# Altium schematic sheet external_devices.SchDoc
size A4; SheetNumber: 4; SheetTotal: 4
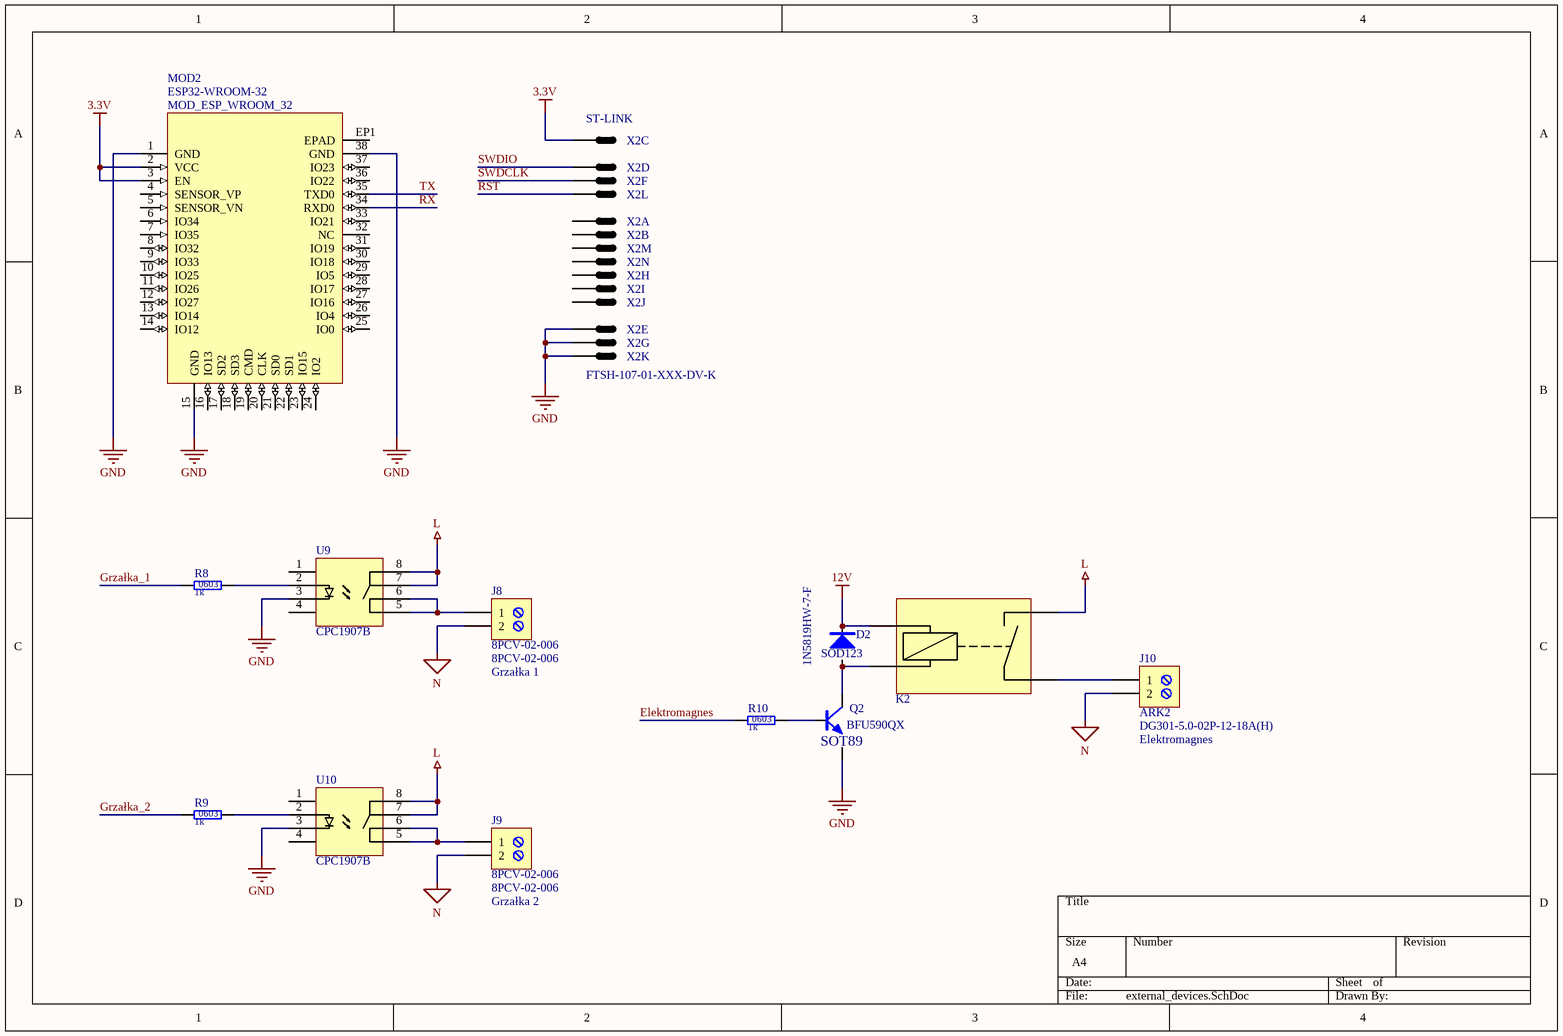
[diagram p0: external_devices.SchDoc]

## Parts
D2  value 1N5819HW-7-F  [SOD123]  (hidden comment: 1N5819HW)
J8  value 8PCV-02-006  [J_8PCV-02-006]  (hidden comment: 600V 30A connector)
J9  value 8PCV-02-006  [J_8PCV-02-006]  (hidden comment: 600V 30A connector)
J10  value DG301-5.0-02P-12-18A(H)  [J_ARK2]  (hidden comment: ARK2)
K2  FTR-F3AA012E  [FTR-F3AA012E]  (value not drawn)
MOD2  value ESP32-WROOM-32  [MOD_ESP_WROOM_32]  (hidden comment: 2.4 GHz Wi-Fi-and-Bluetooth combo chip)
Q2  SCH_Footprint: SOT89  [SOT89_TO-243AA_N]  (hidden comment: BFU590QX)
R8  value 1k  SCH_Footprint: 0603  [R_0603_1608]  (hidden comment: Resistor)
R9  value 1k  SCH_Footprint: 0603  [R_0603_1608]  (hidden comment: Resistor)
R10  value 1k  SCH_Footprint: 0603  [R_0603_1608]  (hidden comment: Resistor)
U9  CPC1907B  [CPC1907B]
U10  CPC1907B  [CPC1907B]
X2  FTSH-107-01-XXX-DV-K  [FTSH-107-01-XXX-DV-K]  (value not drawn)  (parts A,B,C,D,E,F,G,H,I,J,K,L,M,N of 14)

## Nets
3.3V: MOD2.2(VCC) MOD2.3(EN) X2.3
12V: D2.1 K2.1
GND: MOD2.1(GND) MOD2.15(GND) MOD2.38(GND) Q2.1(E) U9.3 U10.3 X2.5 X2.7 X2.11
L: K2.3 U9.7 U9.8 U10.7 U10.8
N: J8.2 J9.2 J10.2
Elektromagnes: R10.1
Grzałka_1: R8.1
Grzałka_2: R9.1
RST: X2.12
RX: MOD2.34(RXD0)
SWDCLK: X2.6
SWDIO: X2.4
TX: MOD2.35(TXD0)
NetD2_2: D2.2 K2.2 Q2.2(C)
NetJ8_1: J8.1 U9.5 U9.6
NetJ9_1: J9.1 U10.5 U10.6
NetJ10_1: J10.1 K2.4
NetQ2_3: Q2.3(B) R10.2
NetR8_2: R8.2 U9.2
NetR9_2: R9.2 U10.2

Not connected (* = marked no-connect by the designer): MOD2 4(SENSOR_VP) 5(SENSOR_VN) 6(IO34) 7(IO35) 8(IO32) 9(IO33) 10(IO25) 11(IO26) 12(IO27) 13(IO14) 14(IO12) 16(IO13) 17(SD2) 18(SD3) 19(CMD) 20(CLK) 21(SD0) 22(SD1) 23(IO15) 24(IO2) 25(IO0) 26(IO4) 27(IO16) 28(IO17) 29(IO5) 30(IO18) 31(IO19) 32(NC) 33(IO21) 36(IO22) 37(IO23) EP1(EPAD); U9 1 4; U10 1 4; X2 1 2 8 9 10 13 14

## Notes on the sheet
- (near X2) ST-LINK
- (near J8) Grzałka 1
- (near J10) Elektromagnes
- (near J9) Grzałka 2

## Library data of the parts
D2 = D_1N5819HW_1A_40V_SOD123: Manufacturer: Diodes Inc; Voltage: 40V; Current: 1A; SCH_Footprint: SOD123; Part Number: D_1N5819HW_1A_40V_SOD123; HelpURL: https://datasheet.octopart.com/1N5819HW-7-F-Diodes-Inc.-datasheet-8332965.pdf; Manufacturer Part Number: 1N5819HW-7-F; Supplier 1: TME; Supplier Part Number 1: 1N5819HW-7-F; Supplier 2: RS Components; Supplier Part Number 2: 7082197; Supplier 3: Farnell; Supplier Part Number 3: 1773475; Supplier 4: Mouser; Supplier Part Number 4: 621-1N5819HW-F; Supplier 5: Digi-Key; Supplier Part Number 5: 1N5819HW-FDICT-ND; Supplier 6: LCSC
J8 J9 = J_8PCV-02-006: ARK Screw terminal, 2-Pin; Manufacturer: TE Connectivity; SCH_Footprint: 8PCV-02-006; Part Number: J_8PCV-02-006; HelpURL: http://www.mouser.com/ds/2/418/NG_CD_6-1437657-3_K4-669783.pdf; Manufacturer Part Number: 8PCV-02-006; Supplier 1: TME; Supplier 2: RS Components; Supplier Part Number 2: 7176637; Supplier 3: Farnell; Supplier 4: Mouser; Supplier Part Number 4: 571-514376577; Supplier 5: Digi-Key; Supplier Part Number 5: A98460-ND; Supplier 6: LCSC
J10 = J_TB-5.0-P-2P: ARK Screw terminal, 2-Pin; Manufacturer: DEGSON ELECTRONICS; SCH_Footprint: ARK2; Part Number: J_TB-5.0-P-2P; HelpURL: https://datasheet.octopart.com/DG301-5.0-03P-12-18A%28H%29-Degson-datasheet-17801202.pdf; Manufacturer Part Number: DG301-5.0-02P-12-18A(H); Supplier 1: TME; Supplier Part Number 1: DG301-5.0-2/6B; Supplier 2: RS Components; Supplier 3: Farnell; Supplier 4: Mouser; Supplier 5: Digi-Key; Supplier 6: LCSC
MOD2 = MOD_ESP32-WROOM-32: Manufacturer: ESPRESSIF; SCH_Footprint: MOD_ESP_WROOM_32; Part Number: MOD_ESP32-WROOM-32; HelpURL: https://www.espressif.com/sites/default/files/documentation/esp32-wroom-32d_esp32-wroom-32u_datasheet_en.pdf; Manufacturer Part Number: ESP32-WROOM-32; Supplier 1: TME; Supplier Part Number 1: ESP32-WROOM-32; Supplier 2: RS Components; Supplier Part Number 2: 169-7594; Supplier 3: Farnell; Supplier 4: Mouser; Supplier Part Number 4: 356-ESP-WROOM-32; Supplier 5: Digi-Key; Supplier Part Number 5: 1904-1010-1-ND; Supplier 6: LCSC
Q2 = QNP_BFU590QX: Manufacturer: NXP; Type: NPN; Voltage: 12V; Current: 200mA; Part Number: QNP_BFU590QX; Value: BFU590QX; HelpURL: https://www.nxp.com/docs/en/data-sheet/BFU590Q.pdf; Manufacturer Part Number: BFU590QX; Supplier 1: TME; Supplier 2: RS Components; Supplier 3: Farnell; Supplier Part Number 3: 2776273; Supplier 4: Mouser; Supplier Part Number 4: 771-BFU590QX; Supplier 5: Digi-Key; Supplier Part Number 5: 568-11522-1-ND; Supplier 6: LCSC
R8-R10 = R_1k_0603_1: Manufacturer: Vishay; Manufacturer Part Number: CRCW06031K00FKEA; Voltage: 75V; Power: 100mW; Tolerance: 1%; Part Number: R_1k_0603_1; HelpURL: http://www.farnell.com/datasheets/2310790.pdf?_ga=2.256888843.1690599162.1548417389-1379097396.1542296996&_gac=1.262631934.1547230258.Cj0KCQiAmuHhBRD0ARIsAFWyPwhX8HcvXnM3tA0ZBodZLzDIjH2ZxLpjT5LWo9bad_HPRbU8LfPq44UaAhEwEALw_wcB; Supplier 1: TME; Supplier 2: RS Components; Supplier Part Number 2: 678-9875P; Supplier 3: Farnell; Supplier Part Number 3: 1469740; Supplier 4: Mouser; Supplier Part Number 4: 71-CRCW0603-1.0K-E3; Supplier 5: Digi-Key; Supplier Part Number 5: 541-1.00KHCT-ND; Supplier 6: LCSC
X2 = FTSH-107-01-XXX-DV-K: IDC 14pin male connector